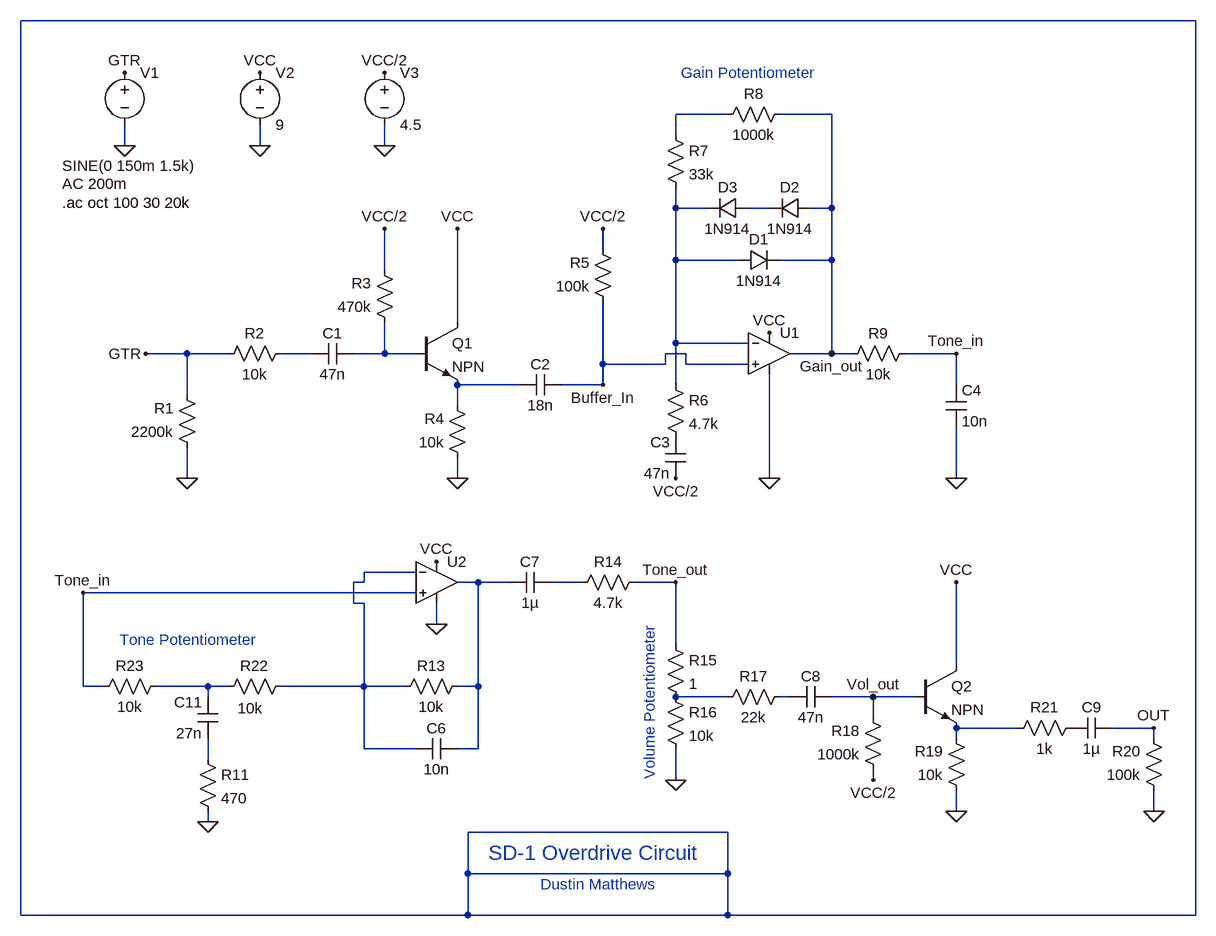
[diagram p0: schematic SD-1_Schem.asc]
SD-1_Schem.asc, the LTspice schematic file:
Version 4
SHEET 1 2548 680
WIRE 1456 -880 -352 -880
WIRE 736 -736 656 -736
WIRE 896 -736 816 -736
WIRE 656 -704 656 -736
WIRE -192 -688 -192 -720
WIRE 16 -688 16 -720
WIRE 208 -688 208 -720
WIRE 656 -592 656 -624
WIRE 704 -592 656 -592
WIRE 800 -592 768 -592
WIRE 896 -592 896 -736
WIRE 896 -592 864 -592
WIRE 544 -528 544 -560
WIRE 656 -512 656 -592
WIRE 752 -512 656 -512
WIRE 896 -512 896 -592
WIRE 896 -512 816 -512
WIRE 208 -496 208 -560
WIRE 320 -416 320 -560
WIRE 656 -384 656 -512
WIRE 768 -384 656 -384
WIRE -96 -368 -160 -368
WIRE -32 -368 -96 -368
WIRE 96 -368 48 -368
WIRE 208 -368 208 -416
WIRE 208 -368 160 -368
WIRE 256 -368 208 -368
WIRE 672 -368 640 -368
WIRE 896 -368 896 -512
WIRE 896 -368 832 -368
WIRE 928 -368 896 -368
WIRE 1088 -368 1008 -368
WIRE 544 -352 544 -448
WIRE 640 -352 640 -368
WIRE 640 -352 544 -352
WIRE 672 -352 672 -368
WIRE 768 -352 672 -352
WIRE 416 -320 320 -320
WIRE 544 -320 544 -352
WIRE 544 -320 480 -320
WIRE 656 -320 656 -384
WIRE 1088 -320 1088 -368
WIRE -96 -304 -96 -368
WIRE 320 -288 320 -320
WIRE -96 -176 -96 -224
WIRE 320 -176 320 -208
WIRE 800 -176 800 -336
WIRE 1088 -176 1088 -256
WIRE 256 -32 176 -32
WIRE 176 -16 176 -32
WIRE 176 -16 160 -16
WIRE 352 -16 320 -16
WIRE 400 -16 352 -16
WIRE 512 -16 464 -16
WIRE 656 -16 592 -16
WIRE 256 0 -256 0
WIRE 160 16 160 -16
WIRE 176 16 160 16
WIRE 288 48 288 16
WIRE 656 80 656 -16
WIRE 1088 112 1088 -16
WIRE -256 144 -256 0
WIRE -224 144 -256 144
WIRE -64 144 -144 144
WIRE -32 144 -64 144
WIRE 176 144 176 16
WIRE 176 144 48 144
WIRE 240 144 176 144
WIRE 352 144 352 -16
WIRE 352 144 320 144
WIRE -64 160 -64 144
WIRE 736 160 656 160
WIRE 832 160 816 160
WIRE 960 160 896 160
WIRE 1024 160 960 160
WIRE 960 192 960 160
WIRE 1184 208 1088 208
WIRE 1392 208 1328 208
WIRE 1088 224 1088 208
WIRE 1392 224 1392 208
WIRE 176 240 176 144
WIRE 256 240 176 240
WIRE 352 240 352 144
WIRE 352 240 320 240
WIRE -64 256 -64 224
WIRE 656 288 656 240
WIRE 960 288 960 272
WIRE 1088 336 1088 304
WIRE 1392 336 1392 304
WIRE -64 352 -64 336
WIRE 736 368 336 368
WIRE 336 432 336 368
WIRE 736 432 736 368
WIRE 736 432 336 432
WIRE -352 496 -352 -880
WIRE 336 496 336 432
WIRE 336 496 -352 496
WIRE 736 496 736 432
WIRE 736 496 336 496
WIRE 1456 496 1456 -880
WIRE 1456 496 736 496
FLAG -192 -688 0
FLAG 16 -688 0
FLAG 208 -688 0
FLAG -192 -800 GTR
FLAG 16 -800 VCC
FLAG 208 -800 VCC/2
FLAG 208 -560 VCC/2
FLAG -96 -176 0
FLAG -160 -368 GTR
FLAG 320 -176 0
FLAG 320 -560 VCC
FLAG 544 -560 VCC/2
FLAG 544 -320 Buffer_In
FLAG 1088 -176 0
FLAG 656 -176 VCC/2
FLAG 800 -176 0
FLAG 800 -400 VCC
FLAG 896 -368 Gain_out
FLAG 1088 -368 Tone_in
FLAG 288 -48 VCC
FLAG 288 48 0
FLAG 656 288 0
FLAG 1088 -16 VCC
FLAG 960 288 VCC/2
FLAG 1088 336 0
FLAG 1392 336 0
FLAG 1392 208 OUT
FLAG 656 -16 Tone_out
FLAG 960 160 Vol_out
FLAG -256 0 Tone_in
FLAG -64 352 0
SYMBOL voltage -192 -816 R0
WINDOW 3 -96 159 Left 2
WINDOW 123 -96 187 Left 2
WINDOW 39 0 0 Left 0
SYMATTR Value SINE(0 150m 1.5k)
SYMATTR Value2 AC 200m
SYMATTR InstName V1
SYMBOL voltage 16 -816 R0
WINDOW 123 0 0 Left 0
WINDOW 39 0 0 Left 0
SYMATTR InstName V2
SYMATTR Value 9
SYMBOL voltage 208 -816 R0
WINDOW 123 0 0 Left 0
WINDOW 39 0 0 Left 0
SYMATTR InstName V3
SYMATTR Value 4.5
SYMBOL res -80 -208 R180
WINDOW 0 36 76 Left 2
WINDOW 3 36 40 Left 2
SYMATTR InstName R1
SYMATTR Value 2200k
SYMBOL res -48 -352 R270
WINDOW 0 32 56 VTop 2
WINDOW 3 0 56 VBottom 2
SYMATTR InstName R2
SYMATTR Value 10k
SYMBOL res 224 -400 R180
WINDOW 0 36 76 Left 2
WINDOW 3 36 40 Left 2
SYMATTR InstName R3
SYMATTR Value 470k
SYMBOL res 336 -192 R180
WINDOW 0 36 76 Left 2
WINDOW 3 36 40 Left 2
SYMATTR InstName R4
SYMATTR Value 10k
SYMBOL res 560 -432 R180
WINDOW 0 36 76 Left 2
WINDOW 3 36 40 Left 2
SYMATTR InstName R5
SYMATTR Value 100k
SYMBOL cap 96 -352 R270
WINDOW 0 32 32 VTop 2
WINDOW 3 0 32 VBottom 2
SYMATTR InstName C1
SYMATTR Value 47n
SYMBOL cap 416 -304 R270
WINDOW 0 32 32 VTop 2
WINDOW 3 0 32 VBottom 2
SYMATTR InstName C2
SYMATTR Value 18n
SYMBOL npn 256 -416 R0
SYMATTR InstName Q1
SYMBOL Opamps\\UniversalOpamp2 800 -368 R0
SYMATTR InstName U1
SYMBOL cap 672 -176 R180
WINDOW 0 24 56 Left 2
WINDOW 3 24 8 Left 2
SYMATTR InstName C3
SYMATTR Value 47n
SYMBOL res 640 -336 R0
SYMATTR InstName R6
SYMATTR Value 4.7k
SYMBOL res 640 -720 R0
SYMATTR InstName R7
SYMATTR Value 33k
SYMBOL res 832 -752 R90
WINDOW 0 0 56 VBottom 2
WINDOW 3 32 56 VTop 2
SYMATTR InstName R8
SYMATTR Value 1000k
SYMBOL res 1024 -384 R90
WINDOW 0 0 56 VBottom 2
WINDOW 3 32 56 VTop 2
SYMATTR InstName R9
SYMATTR Value 10k
SYMBOL cap 1072 -320 R0
SYMATTR InstName C4
SYMATTR Value 10n
SYMBOL diode 752 -496 R270
WINDOW 0 32 32 VTop 2
WINDOW 3 0 32 VBottom 2
SYMATTR InstName D1
SYMATTR Value 1N914
SYMBOL diode 768 -608 R90
WINDOW 0 0 32 VBottom 2
WINDOW 3 32 32 VTop 2
SYMATTR InstName D3
SYMATTR Value 1N914
SYMBOL diode 864 -608 R90
WINDOW 0 0 32 VBottom 2
WINDOW 3 32 32 VTop 2
SYMATTR InstName D2
SYMATTR Value 1N914
SYMBOL Opamps\\UniversalOpamp2 288 -16 R0
SYMATTR InstName U2
SYMBOL res 336 128 R90
WINDOW 0 0 56 VBottom 2
WINDOW 3 32 56 VTop 2
SYMATTR InstName R13
SYMATTR Value 10k
SYMBOL res 608 -32 R90
WINDOW 0 0 56 VBottom 2
WINDOW 3 32 56 VTop 2
SYMATTR InstName R14
SYMATTR Value 4.7k
SYMBOL cap 320 224 R90
WINDOW 0 0 32 VBottom 2
WINDOW 3 32 32 VTop 2
SYMATTR InstName C6
SYMATTR Value 10n
SYMBOL cap 464 -32 R90
WINDOW 0 0 32 VBottom 2
WINDOW 3 32 32 VTop 2
SYMATTR InstName C7
SYMATTR Value 1µ
SYMBOL res 640 64 R0
SYMATTR InstName R15
SYMATTR Value 1
SYMBOL res 640 144 R0
SYMATTR InstName R16
SYMATTR Value 10k
SYMBOL res 832 144 R90
WINDOW 0 0 56 VBottom 2
WINDOW 3 32 56 VTop 2
SYMATTR InstName R17
SYMATTR Value 22k
SYMBOL res 976 288 R180
WINDOW 0 36 76 Left 2
WINDOW 3 36 40 Left 2
SYMATTR InstName R18
SYMATTR Value 1000k
SYMBOL res 1104 320 R180
WINDOW 0 36 76 Left 2
WINDOW 3 36 40 Left 2
SYMATTR InstName R19
SYMATTR Value 10k
SYMBOL res 1408 320 R180
WINDOW 0 36 76 Left 2
WINDOW 3 36 40 Left 2
SYMATTR InstName R20
SYMATTR Value 100k
SYMBOL npn 1024 112 R0
SYMATTR InstName Q2
SYMBOL cap 896 144 R90
WINDOW 0 0 32 VBottom 2
WINDOW 3 32 32 VTop 2
SYMATTR InstName C8
SYMATTR Value 47n
SYMBOL cap 1328 192 R90
WINDOW 0 0 32 VBottom 2
WINDOW 3 32 32 VTop 2
SYMATTR InstName C9
SYMATTR Value 1µ
SYMBOL res 1280 192 R90
WINDOW 0 0 56 VBottom 2
WINDOW 3 32 56 VTop 2
SYMATTR InstName R21
SYMATTR Value 1k
SYMBOL res 64 128 R90
WINDOW 0 0 56 VBottom 2
WINDOW 3 34 63 VTop 2
SYMATTR InstName R22
SYMATTR Value 10k
SYMBOL cap -48 224 R180
WINDOW 0 24 56 Left 2
WINDOW 3 24 8 Left 2
SYMATTR InstName C11
SYMATTR Value 27n
SYMBOL res -128 128 R90
WINDOW 0 0 56 VBottom 2
WINDOW 3 32 56 VTop 2
SYMATTR InstName R23
SYMATTR Value 10k
SYMBOL res -80 240 R0
SYMATTR InstName R11
SYMATTR Value 470
TEXT -288 -600 Left 2 !.ac oct 100 30 20k
TEXT 664 -800 Left 2 ;Gain Potentiometer
TEXT -200 72 Left 2 ;Tone Potentiometer
TEXT 616 48 VRight 2 ;Volume Potentiometer
TEXT 448 448 Left 2 ;Dustin Matthews
TEXT 368 400 Left 3 ;SD-1 Overdrive Circuit

The netlist it stands for:
* SD-1_Schem.asc
V1 GTR 0 SINE(0 150m 1.5k) AC 200m
V2 VCC 0 9
V3 VCC/2 0 4.5
R1 0 GTR 2200k
R2 GTR N005 10k
R3 N006 VCC/2 470k
R4 0 N007 10k
R5 Buffer_In VCC/2 100k
C1 N005 N006 47n
C2 N007 Buffer_In 18n
Q1 VCC N006 N007 0 NPN
XU1 Buffer_In N003 VCC 0 Gain_out level.2 Avol=1Meg GBW=10Meg Slew=10Meg ilimit=25m rail=0 Vos=0 phimargin=45 en=0 enk=0 in=0 ink=0 Rin=500Meg  ; pins IN+ IN- V+ V- OUT
C3 VCC/2 P001 47n
R6 N003 P001 4.7k
R7 N002 N003 33k
R8 Gain_out N002 1000k
R9 Tone_in Gain_out 10k
C4 Tone_in 0 10n
D1 N003 Gain_out 1N914
D3 N004 N003 1N914
D2 Gain_out N004 1N914
XU2 Tone_in N008 VCC 0 N009 level.2 Avol=1Meg GBW=10Meg Slew=10Meg ilimit=25m rail=0 Vos=0 phimargin=45 en=0 enk=0 in=0 ink=0 Rin=500Meg  ; pins IN+ IN- V+ V- OUT
R13 N009 N008 10k
R14 Tone_out N010 4.7k
C6 N009 N008 10n
C7 N010 N009 1µ
R15 Tone_out N012 1
R16 N012 0 10k
R17 N013 N012 22k
R18 VCC/2 Vol_out 1000k
R19 0 N014 10k
R20 0 OUT 100k
Q2 VCC Vol_out N014 0 NPN
C8 Vol_out N013 47n
C9 OUT P002 1µ
R21 P002 N014 1k
R22 N008 N011 10k
C11 N015 N011 27n
R23 N011 Tone_in 10k
R11 N015 0 470
.model D D
.lib standard.dio
.model NPN NPN
.model PNP PNP
.lib standard.bjt
.ac oct 100 30 20k
* Gain Potentiometer
* Tone Potentiometer
* Volume Potentiometer
* Dustin Matthews
* SD-1 Overdrive Circuit
.lib UniversalOpamps2.sub
.backanno
.end